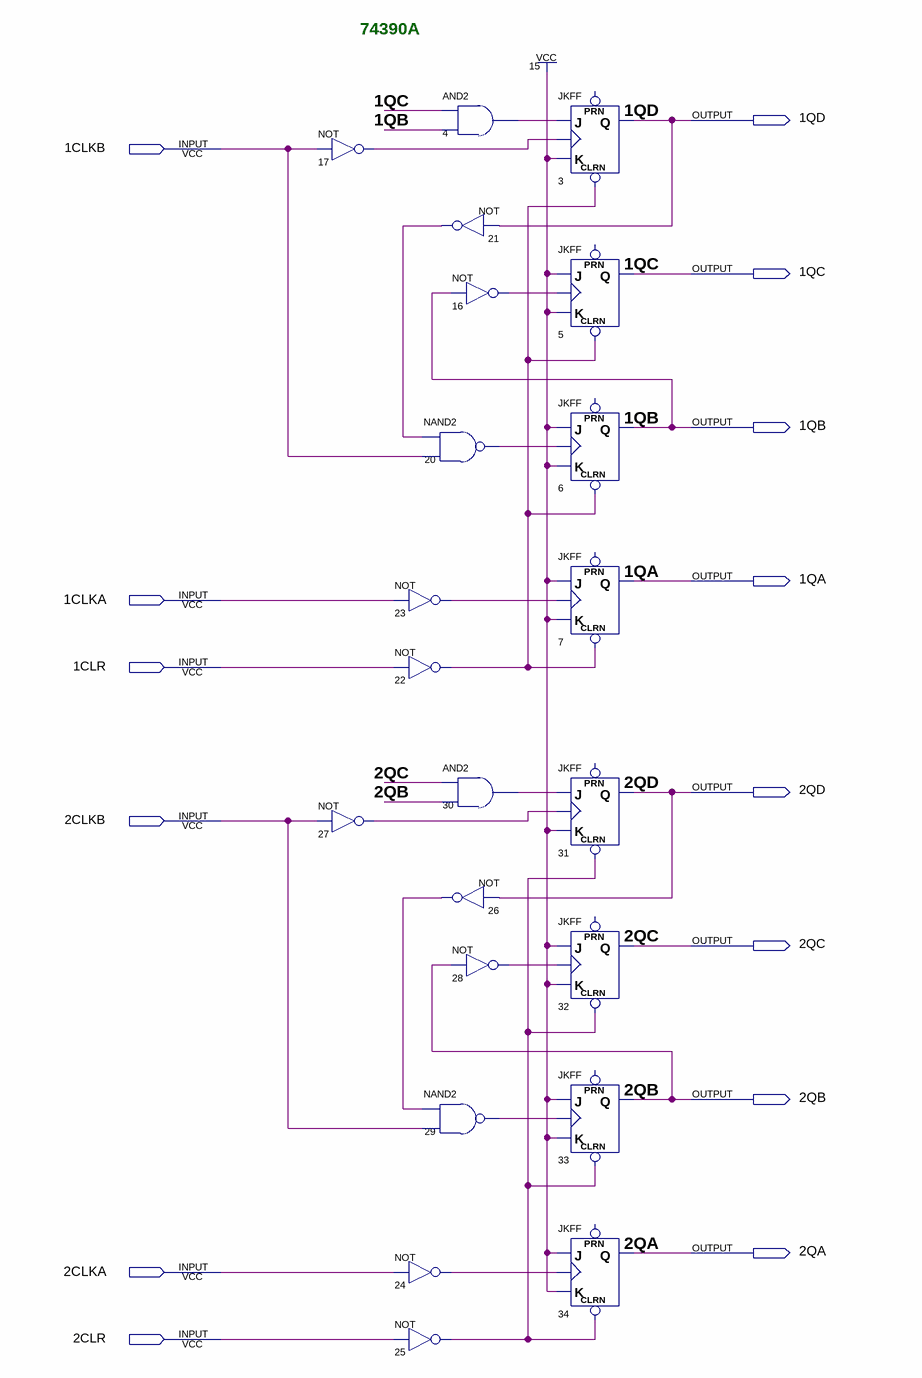
[diagram p0: schematic sheet]
// Quartus schematic 74390.bdf as structural Verilog: 22 symbols, 14 pins
module \74390  (
  input  \1CLKB ,
  input  \1CLKA ,
  input  \1CLR ,
  input  \2CLKB ,
  input  \2CLKA ,
  input  \2CLR ,
  output \1QD ,
  output \1QC ,
  output \1QB ,
  output \1QA ,
  output \2QD ,
  output \2QC ,
  output \2QB ,
  output \2QA 
);

  wire n4_out, n16_out, n17_out, n20_out, n21_out, n22_out, n23_out, n24_out, n25_out, n26_out, n27_out,
       n28_out, n29_out, n30_out;

  not u_17 (n17_out, \1CLKB );
  not u_27 (n27_out, \2CLKB );
  and u_4 (n4_out, \1QC , \1QB );
  not u_21 (n21_out, \1QD );
  not u_16 (n16_out, \1QB );
  nand u_20 (n20_out, n21_out, \1CLKB );
  not u_23 (n23_out, \1CLKA );
  not u_22 (n22_out, \1CLR );
  and u_30 (n30_out, \2QC , \2QB );
  not u_26 (n26_out, \2QD );
  not u_28 (n28_out, \2QB );
  nand u_29 (n29_out, n26_out, \2CLKB );
  not u_24 (n24_out, \2CLKA );
  not u_25 (n25_out, \2CLR );
  JKFF u_3 (.CLRN(n22_out), .K(1'b1), .J(n4_out), .CLK(n17_out), .Q(\1QD ));  // open: PRN
  JKFF u_5 (.CLRN(n22_out), .K(1'b1), .J(1'b1), .CLK(n16_out), .Q(\1QC ));  // open: PRN
  JKFF u_6 (.CLRN(n22_out), .K(1'b1), .J(1'b1), .CLK(n20_out), .Q(\1QB ));  // open: PRN
  JKFF u_7 (.CLRN(n22_out), .K(1'b1), .J(1'b1), .CLK(n23_out), .Q(\1QA ));  // open: PRN
  JKFF u_31 (.CLRN(n25_out), .K(1'b1), .J(n30_out), .CLK(n27_out), .Q(\2QD ));  // open: PRN
  JKFF u_32 (.CLRN(n25_out), .K(1'b1), .J(1'b1), .CLK(n28_out), .Q(\2QC ));  // open: PRN
  JKFF u_33 (.CLRN(n25_out), .K(1'b1), .J(1'b1), .CLK(n29_out), .Q(\2QB ));  // open: PRN
  JKFF u_34 (.CLRN(n25_out), .K(1'b1), .J(1'b1), .CLK(n24_out), .Q(\2QA ));  // open: PRN

  // Notes on the sheet:
  //   74390A
endmodule
